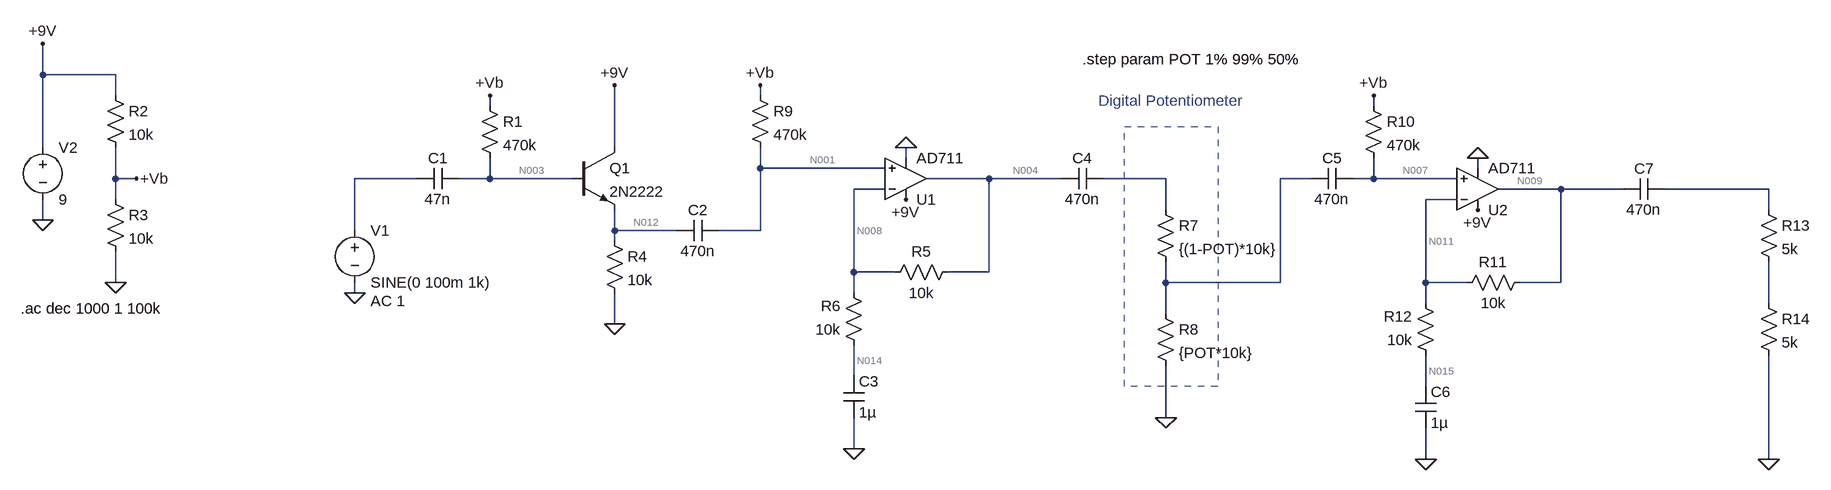
[diagram p0: schematic Liquid Tremolo.asc]
Liquid Tremolo.asc, the LTspice schematic file:
Version 4
SHEET 1 2276 680
WIRE -448 -80 -448 -128
WIRE -336 -80 -448 -80
WIRE -336 -48 -336 -80
WIRE 656 -48 656 -64
WIRE 240 -32 240 -48
WIRE 1600 -32 1600 -48
WIRE -448 32 -448 -80
WIRE 432 32 432 -64
WIRE 880 48 880 32
WIRE 656 64 656 32
WIRE 848 64 656 64
WIRE 1760 64 1760 48
WIRE -336 80 -336 32
WIRE -304 80 -336 80
WIRE 128 80 32 80
WIRE 240 80 240 48
WIRE 240 80 192 80
WIRE 368 80 240 80
WIRE 1008 80 912 80
WIRE 1120 80 1008 80
WIRE 1280 80 1184 80
WIRE 1504 80 1456 80
WIRE 1600 80 1600 48
WIRE 1600 80 1568 80
WIRE 1728 80 1600 80
WIRE 848 96 800 96
WIRE 1888 96 1792 96
WIRE 1984 96 1888 96
WIRE 2208 96 2048 96
WIRE -336 112 -336 80
WIRE 1728 112 1680 112
WIRE 1280 128 1280 80
WIRE 2208 128 2208 96
WIRE -448 144 -448 112
WIRE 32 160 32 80
WIRE 432 160 432 128
WIRE 528 160 432 160
WIRE 656 160 656 64
WIRE 656 160 592 160
WIRE 432 176 432 160
WIRE 800 224 800 96
WIRE 864 224 800 224
WIRE 1008 224 1008 80
WIRE 1008 224 944 224
WIRE -336 240 -336 192
WIRE 1280 240 1280 208
WIRE 1456 240 1456 80
WIRE 1456 240 1280 240
WIRE 1680 240 1680 112
WIRE 1744 240 1680 240
WIRE 1888 240 1888 96
WIRE 1888 240 1824 240
WIRE 32 256 32 240
WIRE 800 256 800 224
WIRE 1680 272 1680 240
WIRE 2208 272 2208 208
WIRE 1280 288 1280 240
WIRE 432 304 432 256
WIRE 800 384 800 336
WIRE 1680 400 1680 352
WIRE 1280 448 1280 368
WIRE 800 496 800 448
WIRE 1680 512 1680 464
WIRE 2208 512 2208 352
FLAG 32 256 0
FLAG 240 -48 +Vb
FLAG -448 144 0
FLAG -336 240 0
FLAG -304 80 +Vb
FLAG 432 304 0
FLAG -448 -128 +9V
FLAG 880 32 0
FLAG 432 -64 +9V
FLAG 880 112 +9V
FLAG 800 496 0
FLAG 1280 448 0
FLAG 656 -64 +Vb
FLAG 1600 -48 +Vb
FLAG 1760 48 0
FLAG 1760 128 +9V
FLAG 1680 512 0
FLAG 2208 512 0
SYMBOL voltage 32 144 R0
WINDOW 123 24 124 Left 2
WINDOW 39 0 0 Left 0
SYMATTR InstName V1
SYMATTR Value SINE(0 100m 1k)
SYMATTR Value2 AC 1
SYMBOL cap 192 64 R90
WINDOW 0 0 32 VBottom 2
WINDOW 3 32 32 VTop 2
SYMATTR InstName C1
SYMATTR Value 47n
SYMBOL res 224 -48 R0
SYMATTR InstName R1
SYMATTR Value 470k
SYMBOL voltage -448 16 R0
WINDOW 123 0 0 Left 0
WINDOW 39 0 0 Left 0
SYMATTR InstName V2
SYMATTR Value 9
SYMBOL res -352 -64 R0
SYMATTR InstName R2
SYMATTR Value 10k
SYMBOL res -352 96 R0
SYMATTR InstName R3
SYMATTR Value 10k
SYMBOL npn 368 32 R0
SYMATTR InstName Q1
SYMATTR Value 2N2222
SYMBOL res 416 160 R0
SYMATTR InstName R4
SYMATTR Value 10k
SYMBOL cap 592 144 R90
WINDOW 0 0 32 VBottom 2
WINDOW 3 32 32 VTop 2
SYMATTR InstName C2
SYMATTR Value 470n
SYMBOL Opamps\\AD711 880 144 M180
SYMATTR InstName U1
SYMBOL res 960 208 R90
WINDOW 0 0 56 VBottom 2
WINDOW 3 32 56 VTop 2
SYMATTR InstName R5
SYMATTR Value 10k
SYMBOL res 816 352 R180
WINDOW 0 36 76 Left 2
WINDOW 3 36 40 Left 2
SYMATTR InstName R6
SYMATTR Value 10k
SYMBOL cap 784 384 R0
SYMATTR InstName C3
SYMATTR Value 1µ
SYMBOL res 1264 112 R0
SYMATTR InstName R7
SYMATTR Value {(1-POT)*10k}
SYMBOL cap 1184 64 R90
WINDOW 0 0 32 VBottom 2
WINDOW 3 32 32 VTop 2
SYMATTR InstName C4
SYMATTR Value 470n
SYMBOL res 1264 272 R0
SYMATTR InstName R8
SYMATTR Value {POT*10k}
SYMBOL res 640 -64 R0
SYMATTR InstName R9
SYMATTR Value 470k
SYMBOL cap 1568 64 R90
WINDOW 0 0 32 VBottom 2
WINDOW 3 32 32 VTop 2
SYMATTR InstName C5
SYMATTR Value 470n
SYMBOL res 1584 -48 R0
SYMATTR InstName R10
SYMATTR Value 470k
SYMBOL Opamps\\AD711 1760 160 M180
SYMATTR InstName U2
SYMBOL res 1840 224 R90
WINDOW 0 0 56 VBottom 2
WINDOW 3 32 56 VTop 2
SYMATTR InstName R11
SYMATTR Value 10k
SYMBOL res 1696 368 R180
WINDOW 0 36 76 Left 2
WINDOW 3 36 40 Left 2
SYMATTR InstName R12
SYMATTR Value 10k
SYMBOL cap 1664 400 R0
SYMATTR InstName C6
SYMATTR Value 1µ
SYMBOL res 2192 112 R0
SYMATTR InstName R13
SYMATTR Value 5k
SYMBOL res 2192 256 R0
SYMATTR InstName R14
SYMATTR Value 5k
SYMBOL cap 2048 80 R90
WINDOW 0 0 32 VBottom 2
WINDOW 3 32 32 VTop 2
SYMATTR InstName C7
SYMATTR Value 470n
TEXT -482 280 Left 2 !.ac dec 1000 1 100k
TEXT 1176 -40 Left 2 ;Digital Potentiometer
TEXT 1152 -104 Left 2 !.step param POT 1% 99% 50%
RECTANGLE Normal 1360 400 1216 0 2

The netlist it stands for:
* Liquid Tremolo.asc
V1 N002 0 SINE(0 100m 1k) AC 1
C1 N003 N002 47n
R1 +Vb N003 470k
V2 +9V 0 9
R2 +9V +Vb 10k
R3 +Vb 0 10k
Q1 +9V N003 N012 0 2N2222
R4 N012 0 10k
C2 N001 N012 470n
XU1 N001 N008 +9V 0 N004 AD712  ; AD711, pins In+ In- V+ V- OUT
R5 N004 N008 10k
R6 N014 N008 10k
C3 N014 0 1µ
R7 N005 N006 {(1-POT)*10k}
C4 N005 N004 470n
R8 N006 0 {POT*10k}
R9 +Vb N001 470k
C5 N007 N006 470n
R10 +Vb N007 470k
XU2 N007 N011 +9V 0 N009 AD712  ; AD711, pins In+ In- V+ V- OUT
R11 N009 N011 10k
R12 N015 N011 10k
C6 N015 0 1µ
R13 N010 N013 5k
R14 N013 0 5k
C7 N010 N009 470n
.model NPN NPN
.model PNP PNP
.lib standard.bjt
.ac dec 1000 1 100k
* Digital Potentiometer
.step param POT 1% 99% 50%
.lib ADI1.lib
.backanno
.end

* Results of the author's LTspice run, read from the files saved beside the schematic
* Operating Point (first step), zero values left out:
*   pot = 10 m
*   V(n003) = 3.788 V
*   V(+vb) = 4.493 V
*   V(+9v) = 9 V
*   V(n012) = 3.164 V
*   V(n001) = 4.492 V
*   V(n008) = 4.493 V
*   V(n004) = 4.493 V
*   V(n014) = 4.493 V
*   V(n007) = 4.492 V
*   V(n011) = 4.493 V
*   V(n009) = 4.493 V
*   V(n015) = 4.493 V
*   Ic(Q1) = 314.9 µA
*   Ib(Q1) = 1.498 µA
*   Ie(Q1) = -316.4 µA
*   I(R11) = 24.98 pA
*   I(R10) = 24.98 pA
*   I(R9) = 24.98 pA
*   I(R5) = 24.98 pA
*   I(R4) = 316.4 µA
*   I(R3) = 449.3 µA
*   I(R2) = 450.7 µA
*   I(R1) = 1.498 µA
*   I(V2) = -6.846 mA
*   Ix(u1:1) = 24.98 pA
*   Ix(u1:2) = 24.98 pA
*   Ix(u1:3) = 3.04 mA
*   Ix(u1:4) = -3.04 mA
*   Ix(u1:5) = -24.97 pA
*   Ix(u2:1) = 24.98 pA
*   Ix(u2:2) = 24.98 pA
*   Ix(u2:3) = 3.04 mA
*   Ix(u2:4) = -3.04 mA
*   Ix(u2:5) = -24.97 pA